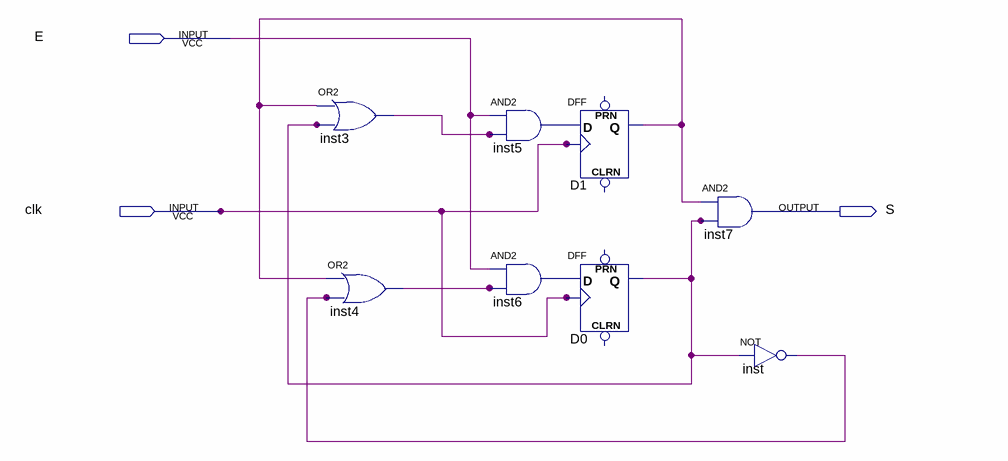
[diagram p0: schematic sheet]
// Quartus schematic practica2.bdf as structural Verilog: 8 symbols, 3 pins
module practica2 (
  input  E,
  input  clk,
  output S
);

  wire D0_q, D1_q, inst3_out, inst4_out, inst5_out, inst6_out, inst_out;

  or inst3 (inst3_out, D1_q, D0_q);
  or inst4 (inst4_out, D1_q, inst_out);
  and inst5 (inst5_out, E, inst3_out);
  and inst6 (inst6_out, E, inst4_out);
  DFF D1 (.CLK(clk), .D(inst5_out), .Q(D1_q));  // open: CLRN, PRN
  DFF D0 (.CLK(clk), .D(inst6_out), .Q(D0_q));  // open: CLRN, PRN
  and inst7 (S, D1_q, D0_q);
  not inst (inst_out, D0_q);
endmodule
